# Altium schematic sheet TControl.schDOC
size A4; Organization: Altium Limited; Address1: L3, 12a Rodborough Rd; Address2: Frenchs Forest; Address3: NSW; Address4: Australia 2086; DocumentNumber: 21; SheetNumber: 21; SheetTotal: 22
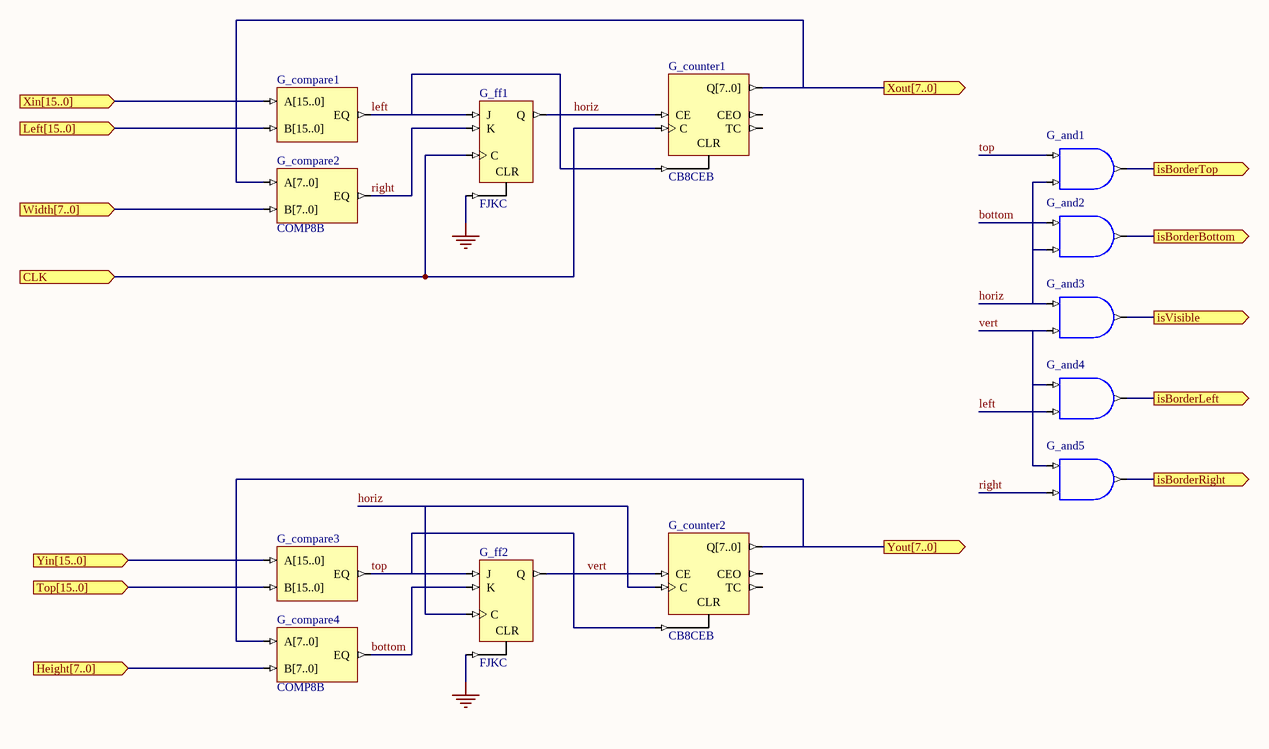
[diagram p0: TControl.schDOC]

## Parts
G_and1  CB8CEB  (value not drawn)
G_and2  CB8CEB  (value not drawn)
G_and3  CB8CEB  (value not drawn)
G_and4  CB8CEB  (value not drawn)
G_and5  CB8CEB  (value not drawn)
G_compare1  COMP8B  (value not drawn)
G_compare2  COMP8B
G_compare3  COMP8B  (value not drawn)
G_compare4  COMP8B
G_counter1  CB8CEB
G_counter2  CB8CEB
G_ff1  FJKC
G_ff2  FJKC

## Ports
CLK (in), Height[7..0] (in), isBorderBottom (out), isBorderLeft (out), isBorderRight (out), isBorderTop (out), isVisible (out), Left[15..0] (in), Top[15..0] (in), Width[7..0] (in), Xin[15..0] (in), Xout[7..0] (out), Yin[15..0] (in), Yout[7..0] (out)

## Nets
GND: G_ff1.CLR G_ff2.CLR
bottom: G_and2.I0 G_compare4.EQ G_ff2.K
CLK: G_counter1.C G_ff1.C ; port CLK
Height[7..0]: G_compare4.B[7..0] ; port Height[7..0]
horiz: G_and1.I1 G_and2.I1 G_and3.I0 G_counter1.CE G_counter2.C G_ff1.Q G_ff2.C
isBorderBottom: G_and2.O ; port isBorderBottom
isBorderLeft: G_and4.O ; port isBorderLeft
isBorderRight: G_and5.O ; port isBorderRight
isBorderTop: G_and1.O ; port isBorderTop
isVisible: G_and3.O ; port isVisible
left: G_and4.I1 G_compare1.EQ G_counter1.CLR G_ff1.J
Left[15..0]: G_compare1.B[15..0] ; port Left[15..0]
right: G_and5.I1 G_compare2.EQ G_ff1.K
top: G_and1.I0 G_compare3.EQ G_counter2.CLR G_ff2.J
Top[15..0]: G_compare3.B[15..0] ; port Top[15..0]
vert: G_and3.I1 G_and4.I0 G_and5.I0 G_counter2.CE G_ff2.Q
Width[7..0]: G_compare2.B[7..0] ; port Width[7..0]
Xin[15..0]: G_compare1.A[15..0] ; port Xin[15..0]
Xout[7..0]: G_compare2.A[7..0] G_counter1.Q[7..0] ; port Xout[7..0]
Yin[15..0]: G_compare3.A[15..0] ; port Yin[15..0]
Yout[7..0]: G_compare4.A[7..0] G_counter2.Q[7..0] ; port Yout[7..0]

Not connected (* = marked no-connect by the designer): G_counter1 CEO TC; G_counter2 CEO TC

## Notes on the sheet
- Title
- Size:
- Date:
- A4
- Number:
- Time:
- Revision:
- Sheet
- of
- File:

## Library data of the parts
G_and1-G_and5 = AND2S: 2-Input AND Gate, Single Pin Version; Xilinx Equivalent: AND2; ArchiveName: GENERIC; Published: 9-30-2003; Publisher: Altium Limited; Core Revision: 1.00.00
G_compare1 G_compare3 = COMP16B: 16-Bit Identity Comparator, Bus Version; Xilinx Equivalent: COMP16; ArchiveName: GENERIC; Published: 9-30-2003; Publisher: Altium Limited; Core Revision: 1.00.00
G_compare2 G_compare4 = COMP8B: 8-Bit Identity Comparator, Bus Version; Xilinx Equivalent: COMP8; ArchiveName: GENERIC; Published: 9-30-2003; Publisher: Altium Limited; Core Revision: 1.00.00
G_counter1 G_counter2 = CB8CEB: 8-Bit Cascadable Binary Counters with Clock Enable and Asynchronous Clear, Bus Version; Xilinx Equivalent: CB8CE; ArchiveName: GENERIC; Published: 9-30-2003; Publisher: Altium Limited; Core Revision: 1.00.00
G_ff1 G_ff2 = FJKC: J-K Flip-Flop with Asynchronous Clear; ArchiveName: GENERIC; Published: 9-30-2003; Publisher: Altium Limited; Xilinx Equivalent: FJKC; Core Revision: 1.00.00